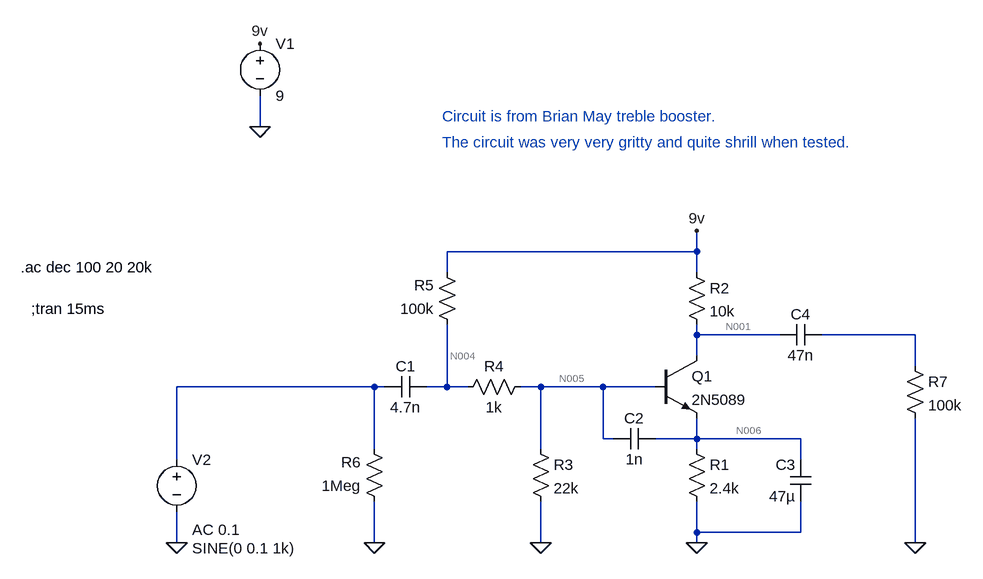
[diagram p0: schematic BJT_Treble_Boost.asc]
BJT_Treble_Boost.asc, the LTspice schematic file:
Version 4
SHEET 1 880 680
WIRE -448 -224 -448 -272
WIRE 224 -32 224 -64
WIRE 224 -32 -160 -32
WIRE -160 0 -160 -32
WIRE 224 0 224 -32
WIRE 224 96 224 80
WIRE 352 96 224 96
WIRE 560 96 416 96
WIRE 224 128 224 96
WIRE 560 144 560 96
WIRE -272 176 -576 176
WIRE -256 176 -272 176
WIRE -160 176 -160 80
WIRE -160 176 -192 176
WIRE -128 176 -160 176
WIRE -16 176 -48 176
WIRE 80 176 -16 176
WIRE 160 176 80 176
WIRE 80 256 80 176
WIRE 96 256 80 256
WIRE 224 256 224 224
WIRE 224 256 160 256
WIRE 384 256 224 256
WIRE -272 272 -272 176
WIRE -16 272 -16 176
WIRE 224 272 224 256
WIRE -576 288 -576 176
WIRE 384 288 384 256
WIRE 224 400 224 352
WIRE 384 400 384 352
WIRE 384 400 224 400
WIRE -576 416 -576 368
WIRE -272 416 -272 352
WIRE -16 416 -16 352
WIRE 224 416 224 400
WIRE 560 416 560 224
FLAG 224 416 0
FLAG -16 416 0
FLAG -272 416 0
FLAG 560 416 0
FLAG -448 -224 0
FLAG -448 -352 9v
FLAG 224 -64 9v
FLAG -576 416 0
SYMBOL npn 160 128 R0
SYMATTR InstName Q1
SYMATTR Value 2N5089
SYMBOL res 208 256 R0
SYMATTR InstName R1
SYMATTR Value 2.4k
SYMBOL res 208 -16 R0
SYMATTR InstName R2
SYMATTR Value 10k
SYMBOL res -32 256 R0
SYMATTR InstName R3
SYMATTR Value 22k
SYMBOL res -32 160 R90
WINDOW 0 0 56 VBottom 2
WINDOW 3 32 56 VTop 2
SYMATTR InstName R4
SYMATTR Value 1k
SYMBOL res -144 96 R180
WINDOW 0 36 76 Left 2
WINDOW 3 36 40 Left 2
SYMATTR InstName R5
SYMATTR Value 100k
SYMBOL res -256 368 R180
WINDOW 0 36 76 Left 2
WINDOW 3 36 40 Left 2
SYMATTR InstName R6
SYMATTR Value 1Meg
SYMBOL cap -192 160 R90
WINDOW 0 0 32 VBottom 2
WINDOW 3 32 32 VTop 2
SYMATTR InstName C1
SYMATTR Value 4.7n
SYMBOL cap 160 240 R90
WINDOW 0 0 32 VBottom 2
WINDOW 3 32 32 VTop 2
SYMATTR InstName C2
SYMATTR Value 1n
SYMBOL cap 400 352 R180
WINDOW 0 24 56 Left 2
WINDOW 3 24 8 Left 2
SYMATTR InstName C3
SYMATTR Value 47µ
SYMBOL cap 352 112 R270
WINDOW 0 32 32 VTop 2
WINDOW 3 0 32 VBottom 2
SYMATTR InstName C4
SYMATTR Value 47n
SYMBOL res 544 128 R0
SYMATTR InstName R7
SYMATTR Value 100k
SYMBOL voltage -448 -368 R0
WINDOW 123 0 0 Left 2
WINDOW 39 0 0 Left 2
SYMATTR InstName V1
SYMATTR Value 9
SYMBOL voltage -576 272 R0
WINDOW 3 24 152 Left 2
WINDOW 123 24 124 Left 2
WINDOW 39 0 0 Left 2
SYMATTR Value SINE(0 0.1 1k)
SYMATTR Value2 AC 0.1
SYMATTR InstName V2
TEXT -816 -8 Left 2 !.ac dec 100 20 20k
TEXT -800 56 Left 2 !;tran 15ms
TEXT -168 -240 Left 2 ;Circuit is from Brian May treble booster.
TEXT -168 -200 Left 2 ;The circuit was very very gritty and quite shrill when tested.

The netlist it stands for:
* BJT_Treble_Boost.asc
Q1 N001 N005 N006 0 2N5089
R1 N006 0 2.4k
R2 9v N001 10k
R3 N005 0 22k
R4 N005 N004 1k
R5 N004 9v 100k
R6 0 N003 1Meg
C1 N004 N003 4.7n
C2 N006 N005 1n
C3 0 N006 47µ
C4 N001 N002 47n
R7 N002 0 100k
V1 9v 0 9
V2 N003 0 SINE(0 0.1 1k) AC 0.1
.model NPN NPN
.model PNP PNP
.lib standard.bjt
.ac dec 100 20 20k
;tran 15ms
* Circuit is from Brian May treble booster.
* The circuit was very very gritty and quite shrill when tested.
.backanno
.end

* Results of the author's LTspice run, read from the files saved beside the schematic
* Operating Point, zero values left out:
*   V(n001) = 5.02 V
*   V(n005) = 1.601 V
*   V(n006) = 956.4 mV
*   V(9v) = 9 V
*   V(n004) = 1.674 V
*   Ic(Q1) = 398 µA
*   Ib(Q1) = 511 nA
*   Ie(Q1) = -398.5 µA
*   I(R5) = -73.26 µA
*   I(R4) = -73.26 µA
*   I(R3) = 72.75 µA
*   I(R2) = 398 µA
*   I(R1) = 398.5 µA
*   I(V1) = -471.2 µA